# Altium schematic sheet Power.SchDoc
size A4; SheetNumber: 2; SheetTotal: 4
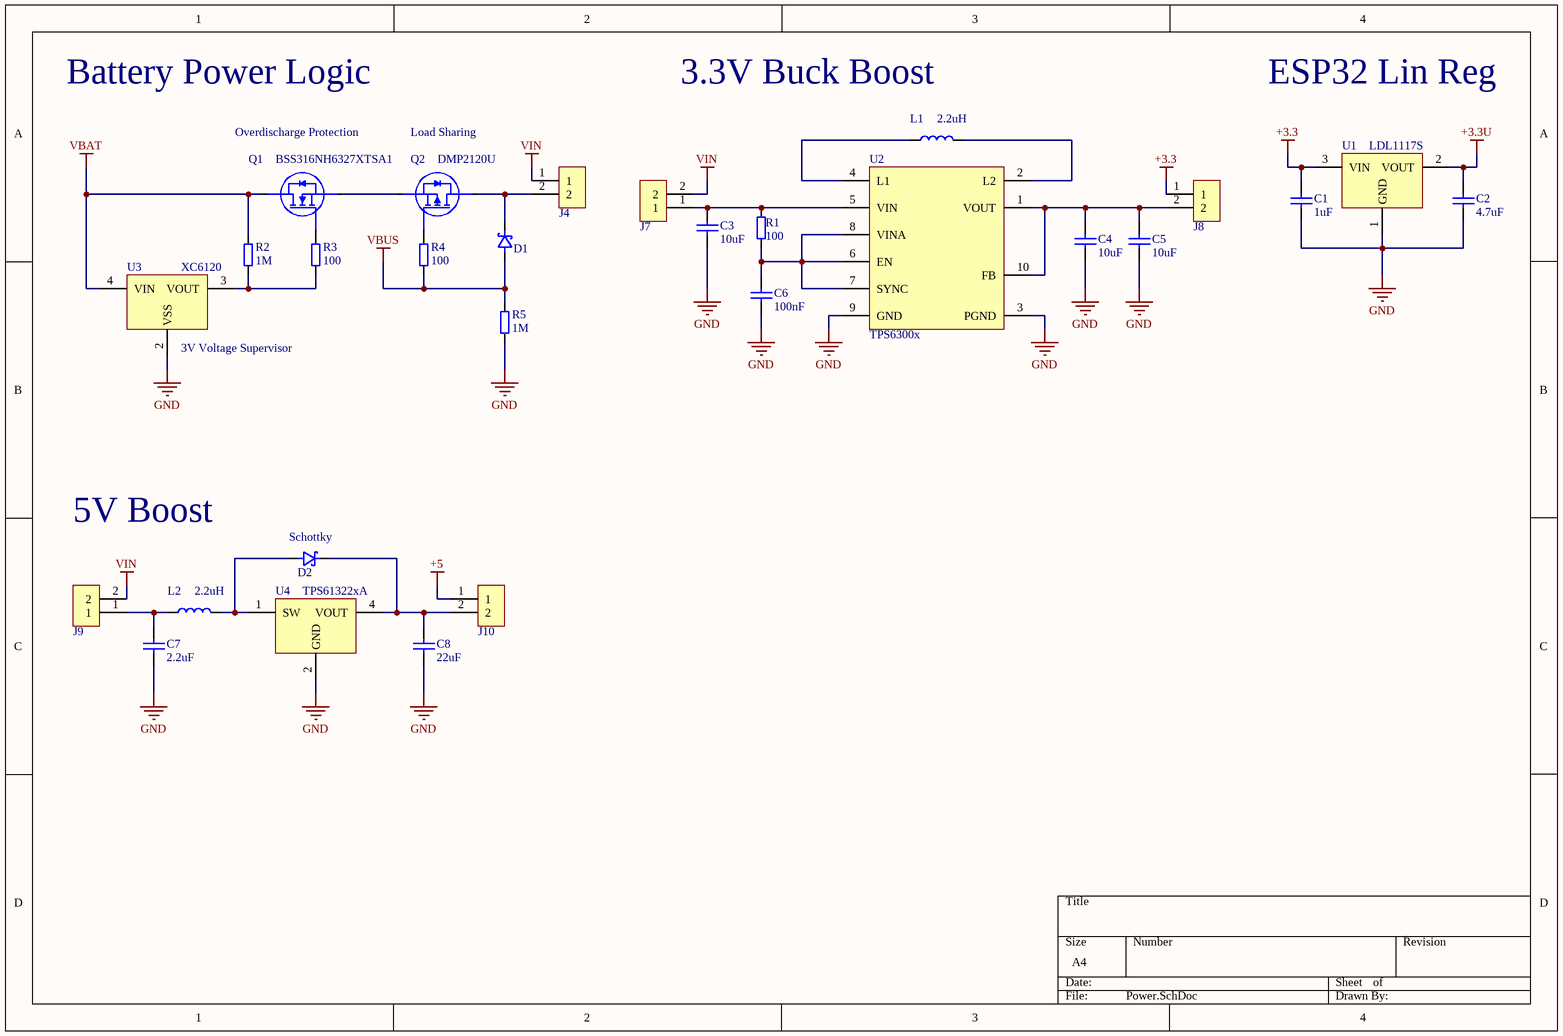
[diagram p0: Power.SchDoc]

## Parts
C1  Capacitance: 1uF  [CAP 0805]  (hidden comment: Capacitor_1uF)
C2  Capacitance: 4.7uF  [CAP 0805]  (hidden comment: Capacitor_4.7uF)
C3  Capacitance: 10uF  [CAP 0805]  (hidden comment: Capacitor_10uF)
C4  Capacitance: 10uF  [CAP 0805]  (hidden comment: Capacitor_10uF)
C5  Capacitance: 10uF  [CAP 0805]  (hidden comment: Capacitor_10uF)
C6  Capacitance: 100nF  [CAP 0805]  (hidden comment: Capacitor_100nF)
C7  Capacitance: 2.2uF  [CAP 0805]  (hidden comment: Capacitor_2.2uF)
C8  Capacitance: 22uF  [CAP 0805]  (hidden comment: Capacitor_22uF)
D1  Diode_Schottky  [DIOM4226X24N]  (value not drawn)
D2  Diode_Schottky  [DIOM4226X24N]  (value not drawn)
J4  1x2 Header  [1x2Header]  (value not drawn)
J7  1x2 Header  [1x2Header]  (value not drawn)
J8  1x2 Header  [1x2Header]  (value not drawn)
J9  1x2 Header  [1x2Header]  (value not drawn)
J10  1x2 Header  [1x2Header]  (value not drawn)
L1  Inductance: 2.2uH  [INDP7575X45N]  (hidden comment: Inductor_2.2uH)
L2  Inductance: 2.2uH  [INDP7575X45N]  (hidden comment: Inductor_2.2uH)
Q1  BSS316NH6327XTSA1  [SOT95P245X110-3N]
Q2  DMP2120U  [SOT95P245X110-3N]
R1  Resistance: 100  [RES 0805]  (hidden comment: Resistor_100)
R2  Resistance: 1M  [RES 0805]  (hidden comment: Resistor_1M)
R3  Resistance: 100  [RES 0805]  (hidden comment: Resistor_100)
R4  Resistance: 100  [RES 0805]  (hidden comment: Resistor_100)
R5  Resistance: 1M  [RES 0805]  (hidden comment: Resistor_1M)
U1  LDL1117S  [SOT223 (Custom)]
U2  TPS6300x  [QFN50P300X300X100_HS-11N]
U3  XC6120  [TSOP130P210X100-4N]
U4  TPS61322xA  [SOT95P280X145-5N]

## Nets
+3.3: C1.2 J8.1 U1.3(VIN)
+3.3U: C2.2 U1.2(VOUT)
+5: J10.1
GND: C1.1 C2.1 C3.1 C4.1 C5.1 C6.1 C7.1 C8.1 R5.2 U1.1(GND) U2.3(PGND) U2.9(GND) U3.2(VSS) U4.2(GND)
VBAT: Q1.3 R2.1 U3.4(VIN)
VBUS: D1.1 R4.2 R5.1
VIN: J4.1 J7.2 J9.2
NetC3_2: C3.2 J7.1 R1.2 U2.5(VIN)
NetC4_2: C4.2 C5.2 J8.2 U2.1(VOUT) U2.10(FB)
NetC6_2: C6.2 R1.1 U2.6(EN) U2.7(SYNC) U2.8(VINA)
NetC7_2: C7.2 J9.1 L2.1
NetC8_2: C8.2 D2.2 J10.2 U4.4(VOUT)
NetD1_2: D1.2 J4.2 Q2.3
NetD2_1: D2.1 L2.2 U4.1(SW)
NetL1_1: L1.1 U2.4(L1)
NetL1_2: L1.2 U2.2(L2)
NetQ1_1: Q1.1 R3.1
NetQ1_2: Q1.2 Q2.2
NetQ2_1: Q2.1 R4.1
NetR2_2: R2.2 R3.2 U3.3(VOUT)

## Notes on the sheet
- Battery Power Logic
- (near L1) 3.3V Buck Boost
- ESP32 Lin Reg
- Overdischarge Protection
- Load Sharing
- (near U3) 3V Voltage Supervisor
- 5V Boost
- (near D2) Schottky

## Library data of the parts
J4 J7-J10 = 1x2_Header
Q1 = BSS316NH6327XTSA1: N-Channel MOSFET
Q2 = DMP2120U: P-Channel MOSFET
U1 = LDL1117S: LDO Linear Regulator
U2 = TPS6300x: Buck-Boost Converter
U3 = XC6120: Voltage Supervisor
U4 = TPS61322xA: Boost Converter